# Altium schematic sheet Board A Thumb MOSFETs.SchDoc
size A4
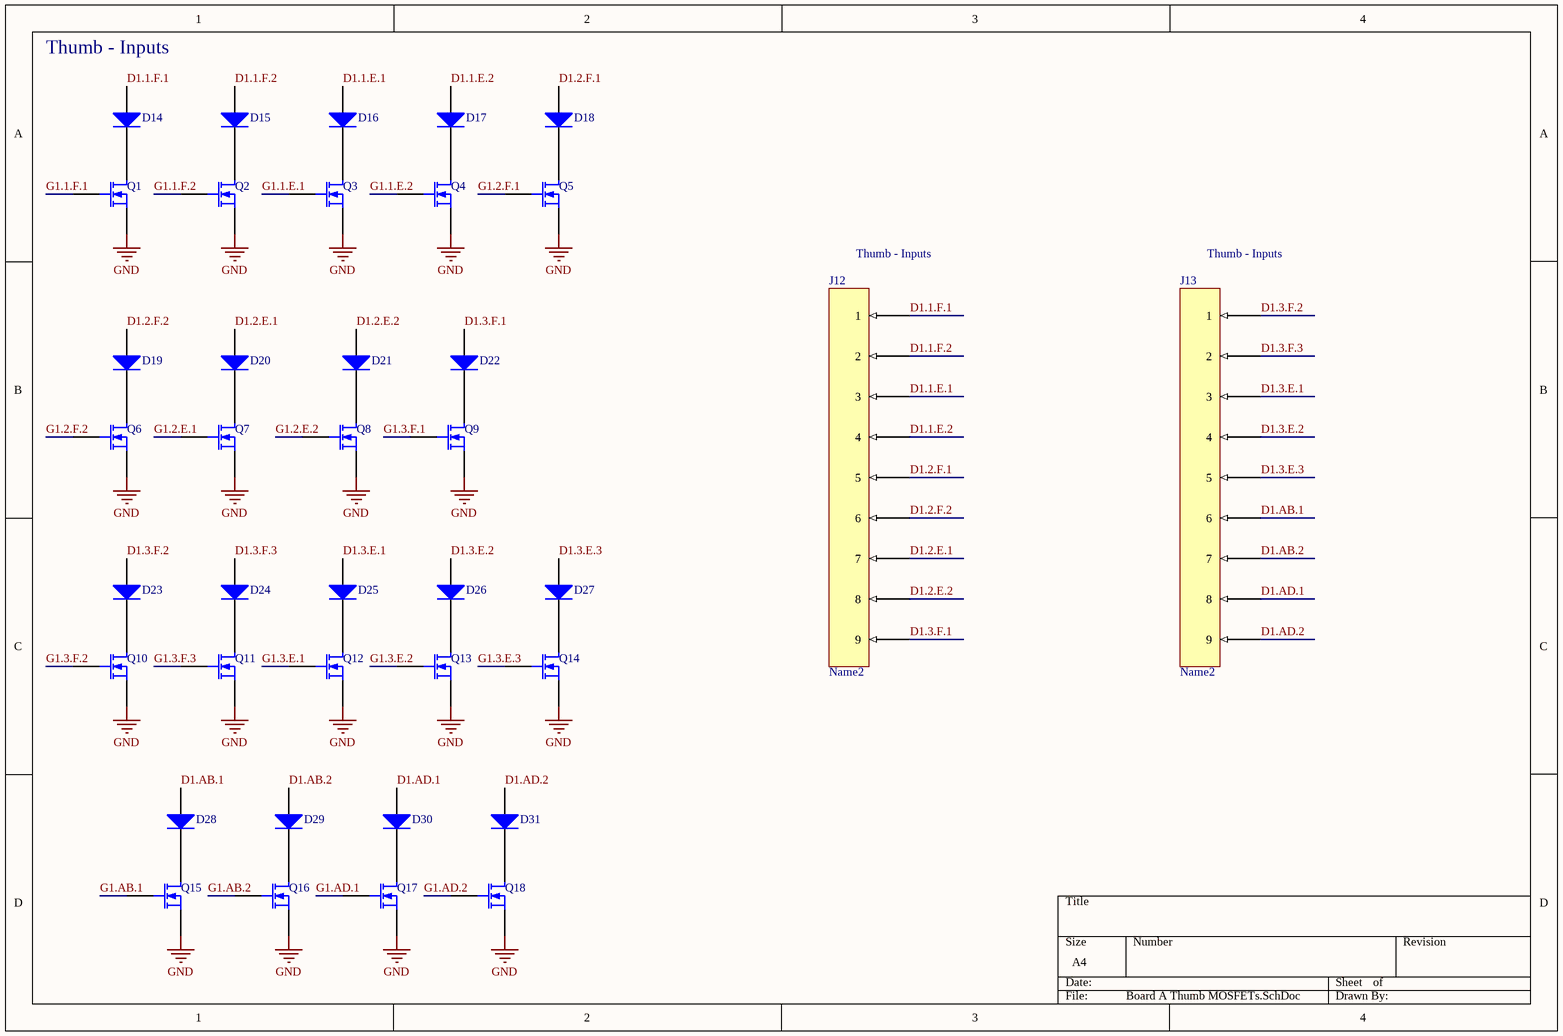
[diagram p0: Board A Thumb MOSFETs.SchDoc]

## Parts
D14  de  [SMC]  (value not drawn)
D15  de  [SMC]  (value not drawn)
D16  de  [SMC]  (value not drawn)
D17  de  [SMC]  (value not drawn)
D18  de  [SMC]  (value not drawn)
D19  de  [SMC]  (value not drawn)
D20  de  [SMC]  (value not drawn)
D21  de  [SMC]  (value not drawn)
D22  de  [SMC]  (value not drawn)
D23  de  [SMC]  (value not drawn)
D24  de  [SMC]  (value not drawn)
D25  de  [SMC]  (value not drawn)
D26  de  [SMC]  (value not drawn)
D27  de  [SMC]  (value not drawn)
D28  de  [SMC]  (value not drawn)
D29  de  [SMC]  (value not drawn)
D30  de  [SMC]  (value not drawn)
D31  de  [SMC]  (value not drawn)
J12  Name2
J13  Name2
Q1  (no value)
Q2  (no value)
Q3  (no value)
Q4  (no value)
Q5  (no value)
Q6  (no value)
Q7  (no value)
Q8  (no value)
Q9  (no value)
Q10  (no value)
Q11  (no value)
Q12  (no value)
Q13  (no value)
Q14  (no value)
Q15  (no value)
Q16  (no value)
Q17  (no value)
Q18  (no value)

## Nets
GND: Q1.3(S) Q2.3(S) Q3.3(S) Q4.3(S) Q5.3(S) Q6.3(S) Q7.3(S) Q8.3(S) Q9.3(S) Q10.3(S) Q11.3(S) Q12.3(S) Q13.3(S) Q14.3(S) Q15.3(S) Q16.3(S) Q17.3(S) Q18.3(S)
D1.1.E.1: D16.1(A) J12.3
D1.1.E.2: D17.1(A) J12.4
D1.1.F.1: D14.1(A) J12.1
D1.1.F.2: D15.1(A) J12.66(2)
D1.2.E.1: D20.1(A) J12.7
D1.2.E.2: D21.1(A) J12.8
D1.2.F.1: D18.1(A) J12.5
D1.2.F.2: D19.1(A) J12.6
D1.3.E.1: D25.1(A) J13.3
D1.3.E.2: D26.1(A) J13.4
D1.3.E.3: D27.1(A) J13.5
D1.3.F.1: D22.1(A) J12.9
D1.3.F.2: D23.1(A) J13.1
D1.3.F.3: D24.1(A) J13.66(2)
D1.AB.1: D28.1(A) J13.6
D1.AB.2: D29.1(A) J13.7
D1.AD.1: D30.1(A) J13.8
D1.AD.2: D31.1(A) J13.9
G1.1.E.1: Q3.2(G)
G1.1.E.2: Q4.2(G)
G1.1.F.1: Q1.2(G)
G1.1.F.2: Q2.2(G)
G1.2.E.1: Q7.2(G)
G1.2.E.2: Q8.2(G)
G1.2.F.1: Q5.2(G)
G1.2.F.2: Q6.2(G)
G1.3.E.1: Q12.2(G)
G1.3.E.2: Q13.2(G)
G1.3.E.3: Q14.2(G)
G1.3.F.1: Q9.2(G)
G1.3.F.2: Q10.2(G)
G1.3.F.3: Q11.2(G)
G1.AB.1: Q15.2(G)
G1.AB.2: Q16.2(G)
G1.AD.1: Q17.2(G)
G1.AD.2: Q18.2(G)
NetD14_2: D14.2(K) Q1.1(D)
NetD15_2: D15.2(K) Q2.1(D)
NetD16_2: D16.2(K) Q3.1(D)
NetD17_2: D17.2(K) Q4.1(D)
NetD18_2: D18.2(K) Q5.1(D)
NetD19_2: D19.2(K) Q6.1(D)
NetD20_2: D20.2(K) Q7.1(D)
NetD21_2: D21.2(K) Q8.1(D)
NetD22_2: D22.2(K) Q9.1(D)
NetD23_2: D23.2(K) Q10.1(D)
NetD24_2: D24.2(K) Q11.1(D)
NetD25_2: D25.2(K) Q12.1(D)
NetD26_2: D26.2(K) Q13.1(D)
NetD27_2: D27.2(K) Q14.1(D)
NetD28_2: D28.2(K) Q15.1(D)
NetD29_2: D29.2(K) Q16.1(D)
NetD30_2: D30.2(K) Q17.1(D)
NetD31_2: D31.2(K) Q18.1(D)

## Notes on the sheet
- Thumb - Inputs

## Library data of the parts
D14-D31 = Diode: Default Diode; Published: 8-Jun-2000; LatestRevisionDate: 17-Jul-2002; LatestRevisionNote: Re-released for DXP Platform.; PackageVersion: Sep-1996; PackageReference: SMC; Publisher: Altium Limited; PackageDescription: DO-214-AB/SMC; 2 C-Bend Leads; Body 7.9 x 5.9 mm, inc. leads (LxW); Code_JEDEC: DO-214-AB; Supplier 1: Digi-Key; Supplier Part Number 1: 1727-5384-1-ND
J12 J13 = Name2: 9 Position header
Q1-Q18 = MOSFET-N: N-Channel MOSFET; Published: 8-Jun-2000; LatestRevisionDate: 17-Jul-2002; LatestRevisionNote: Re-released for DXP Platform.; PackageVersion: 1995/1996; PackageReference: E3; Publisher: Altium Limited; PackageDescription: TO, Flat Index; 3 In-Line, Axial Leads; Body Dia. 4.6mm; Lead Dia. 0.5 mm (max); Supplier 1: Digi-Key; Supplier 2: Digi-Key; Supplier Part Number 2: 497-7462-1-ND